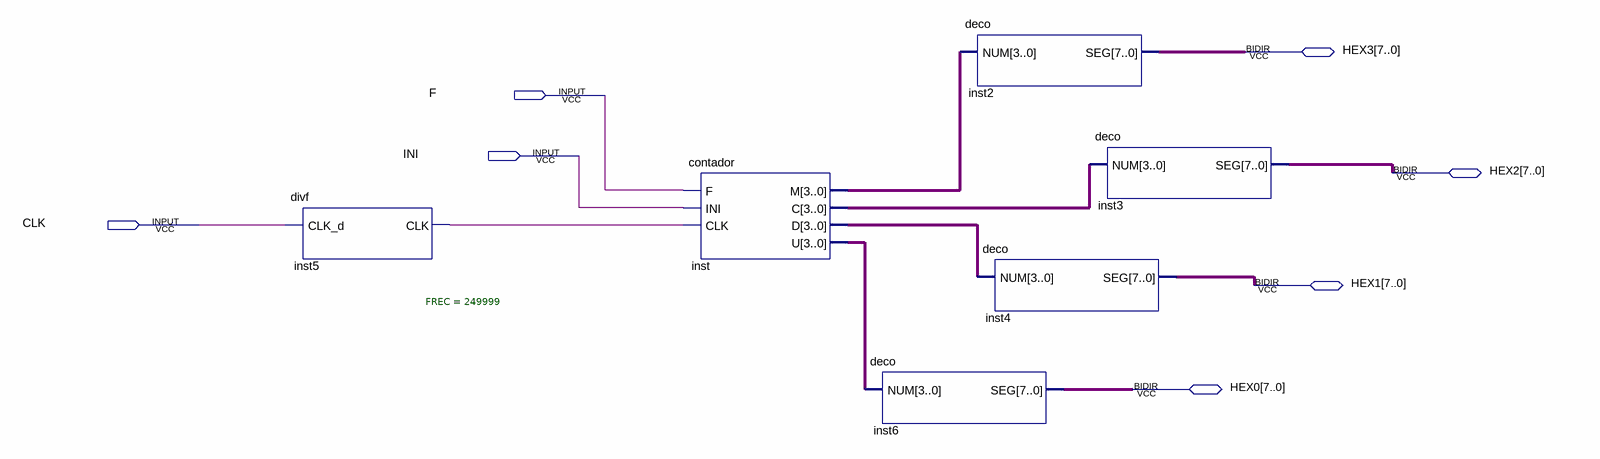
[diagram p0: schematic sheet]
// Quartus schematic PRACTICA1.bdf as structural Verilog: 6 symbols, 7 pins
module PRACTICA1 (
  input  F,
  input  INI,
  input  CLK,
  inout  [7:0] HEX3,
  inout  [7:0] HEX2,
  inout  [7:0] HEX1,
  inout  [7:0] HEX0
);

  wire inst5_clk;
  wire [3:0] inst_c, inst_d, inst_m, inst_u;

  divf #(.FREC(249999)) inst5 (.CLK_d(CLK), .CLK(inst5_clk));
  contador inst (.F(F), .INI(INI), .CLK(inst5_clk), .M(inst_m), .C(inst_c), .D(inst_d), .U(inst_u));
  deco inst6 (.NUM(inst_u), .SEG(HEX0));
  deco inst2 (.NUM(inst_m), .SEG(HEX3));
  deco inst4 (.NUM(inst_d), .SEG(HEX1));
  deco inst3 (.NUM(inst_c), .SEG(HEX2));
endmodule
